# EAGLE design LEDline (EAGLE 8.6.0)
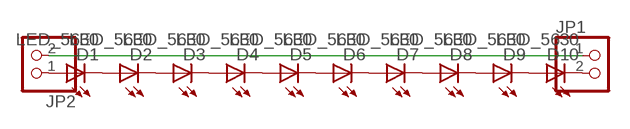
[diagram p0: schematic, sheet 1]

## Parts
D1  LED_5630  [LED5730]
D2  LED_5630  [LED5730]
D3  LED_5630  [LED5730]
D4  LED_5630  [LED5730]
D5  LED_5630  [LED5730]
D6  LED_5630  [LED5730]
D7  LED_5630  [LED5730]
D8  LED_5630  [LED5730]
D9  LED_5630  [LED5730]
D10  LED_5630  [LED5730]
JP1  PINHD-1X2/90  [1X02/90]
JP2  PINHD-1X2/90  [1X02/90]

## Nets
N$1: D1.C D2.A D2.A1(A)
N$2: D2.C D3.A D3.A1(A)
N$3: D3.C D4.A D4.A1(A)
N$4: D4.C D5.A D5.A1(A)
N$5: D5.C D6.A D6.A1(A)
N$6: D6.C D7.A D7.A1(A)
N$7: D7.C D8.A D8.A1(A)
N$8: D8.C D9.A D9.A1(A)
N$9: D9.C D10.A D10.A1(A)
N$10: D10.C JP1.2
N$11: D1.A D1.A1(A) JP2.1
N$12: JP1.1 JP2.2

## Library data of the parts
D1-D10 = Namenlos:LED_
JP1 JP2 = pinhead:PINHD-1X2: PIN HEADER

## Board
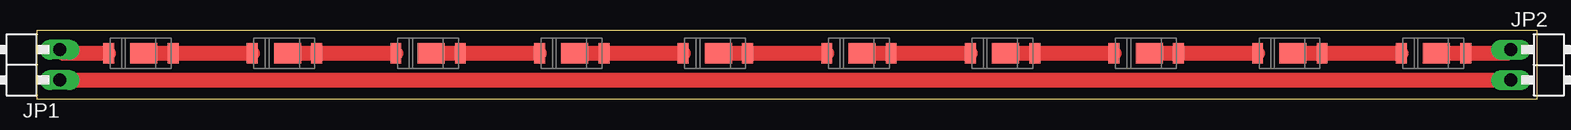
[diagram p1: board, top side]

Size 125.09 x 5.71 mm. Coordinates in mm from the lower left corner, seen from the top.
Outline: 0,0 125.08,0 125.09,5.71 0,5.71 0,0
Copper layers (1*16): Top 0.035mm / dielectric 1.5mm / Bottom 0.035mm
Design rules "default": minimum track width 6mil, minimum drill 0.35mm, track to track 6mil, track to pad 6mil, pad to pad 6mil, via to via 6mil, smd to smd 6mil, copper to edge 40mil, drill to drill 6mil, minimum pad ring 10mil, minimum via ring 8mil, stop-mask expansion 4mil, vias tented up to drill 0mil, thermal gap 10mil

### Footprints (pad centres in the part's own frame; a part is rotated, then mirrored left to right if it is on the bottom)
LED5730 = smd 0.9 x 1.7: A -2.708,-0.014; C 2.672,-0.014 | smd 2.25 x 1.7: A1 -0.263,-0.014
1X02/90 = drill 1.1 long: 1 -1.27,-3.81; 2 1.27,-3.81

### Placement (x,y rotation side)
D1  116.4,3.81 180 top
D2  104.43,3.81 180 top
D3  92.46,3.81 180 top
D4  80.49,3.81 180 top
D5  68.52,3.81 180 top
D6  56.54,3.81 180 top
D7  44.57,3.81 180 top
D8  32.6,3.81 180 top
D9  20.63,3.81 180 top
D10  8.66,3.81 180 top
JP1  -1.91,2.86 90 top
JP2  126.68,2.86 270 top

### Tracks (layer width: path | path; a pad name or v marks a point on that pad's centre or on a via)
N$1
  Top 1.27: D2.A1 D2.A D1.C
N$2
  Top 1.27: D3.A1 D3.A D2.C
N$3
  Top 1.27: D4.A1 D4.A D3.C
N$4
  Top 1.27: D5.A1 D5.A D4.C
N$5
  Top 1.27: D6.A1 D6.A D5.C
N$6
  Top 1.27: D7.A1 D7.A D6.C
N$7
  Top 1.27: D8.A1 D8.A D7.C
N$8
  Top 1.27: D9.A1 D9.A D8.C
N$9
  Top 1.27: D10.A1 D10.A D9.C
N$10
  Top 1.27: JP1.2 2.21,3.82 D10.C
N$11
  Top 0.813: 122.57,3.82 JP2.1
  Top 1.27: D1.A1 D1.A 122.57,3.82
N$12
  Top 1.27: JP1.1 JP2.2